# EAGLE design Potencia_2 (EAGLE 7.5.0)
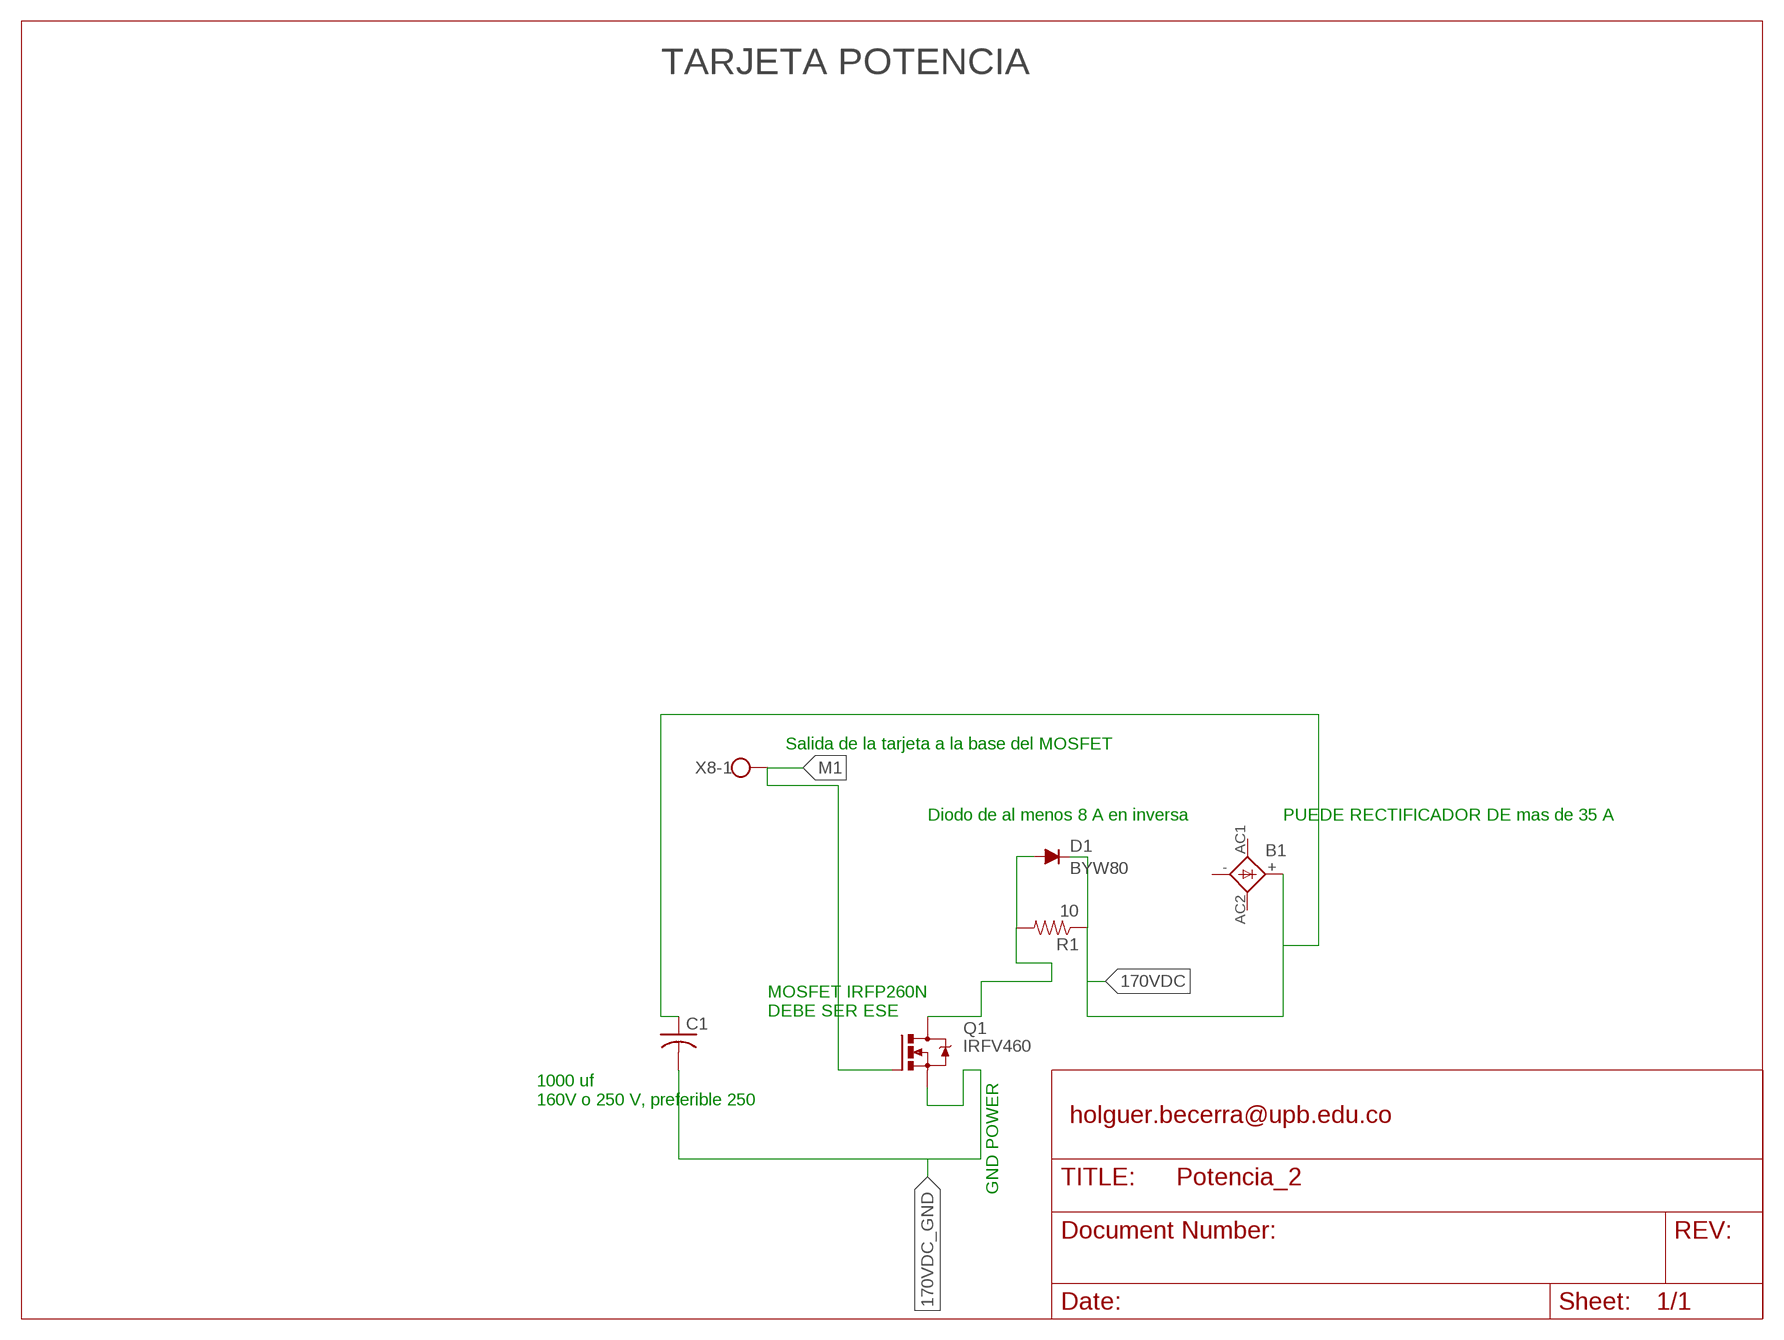
[diagram p0: schematic, sheet 1]

## Parts
B1  GBPC80X  [GBPC80X]
C1  C-US275-205X316  [C275-205X316]
D1  BYW80  [TO220ACS]
Q1  IRFV460  [TO258AA]
R1  10  10OHM-1/10W-5%0603SMD  [0603-RES]
X8  CBE2  [BE2]

## Nets
170VDC: B1.+ C1.1 D1.C R1.1
170VDC_GND: C1.2 Q1.2-S(S)
DAS: D1.A Q1.1-D(D) R1.2
M1: Q1.3-G(G) X8.1
Unconnected: B1.- B1.AC1 B1.AC2 X8.2

## Notes on the sheet
- TARJETA POTENCIA
- Salida de la tarjeta a la base del MOSFET
- Diodo de al menos 8 A en inversa | PUEDE RECTIFICADOR DE mas de 35 A
- MOSFET IRFP260N
  DEBE SER ESE
- 1000 uf
  160V o 250 V, preferible 250
- holguer.becerra@upb.edu.co
- GND POWER

## Library data of the parts
B1 = rectifier:GBPC80X: GENERAL INSTRUMENT RECTIFIER
C1 = adafruit:C-US: CAPACITOR, American symbol
D1 = diode:BYW80: DIODE high-efficiency fast recovery rectifier (ST)
Q1 = transistor-power:IRFV460: HEXFET N-Channel Transistor
R1 = SparkFun-Resistors:10OHM-1/10W-5%0603: RES-09834; PROD_ID: RES-09834
X8 = Bornera_tornillo_enchufable:CBE2

## Board
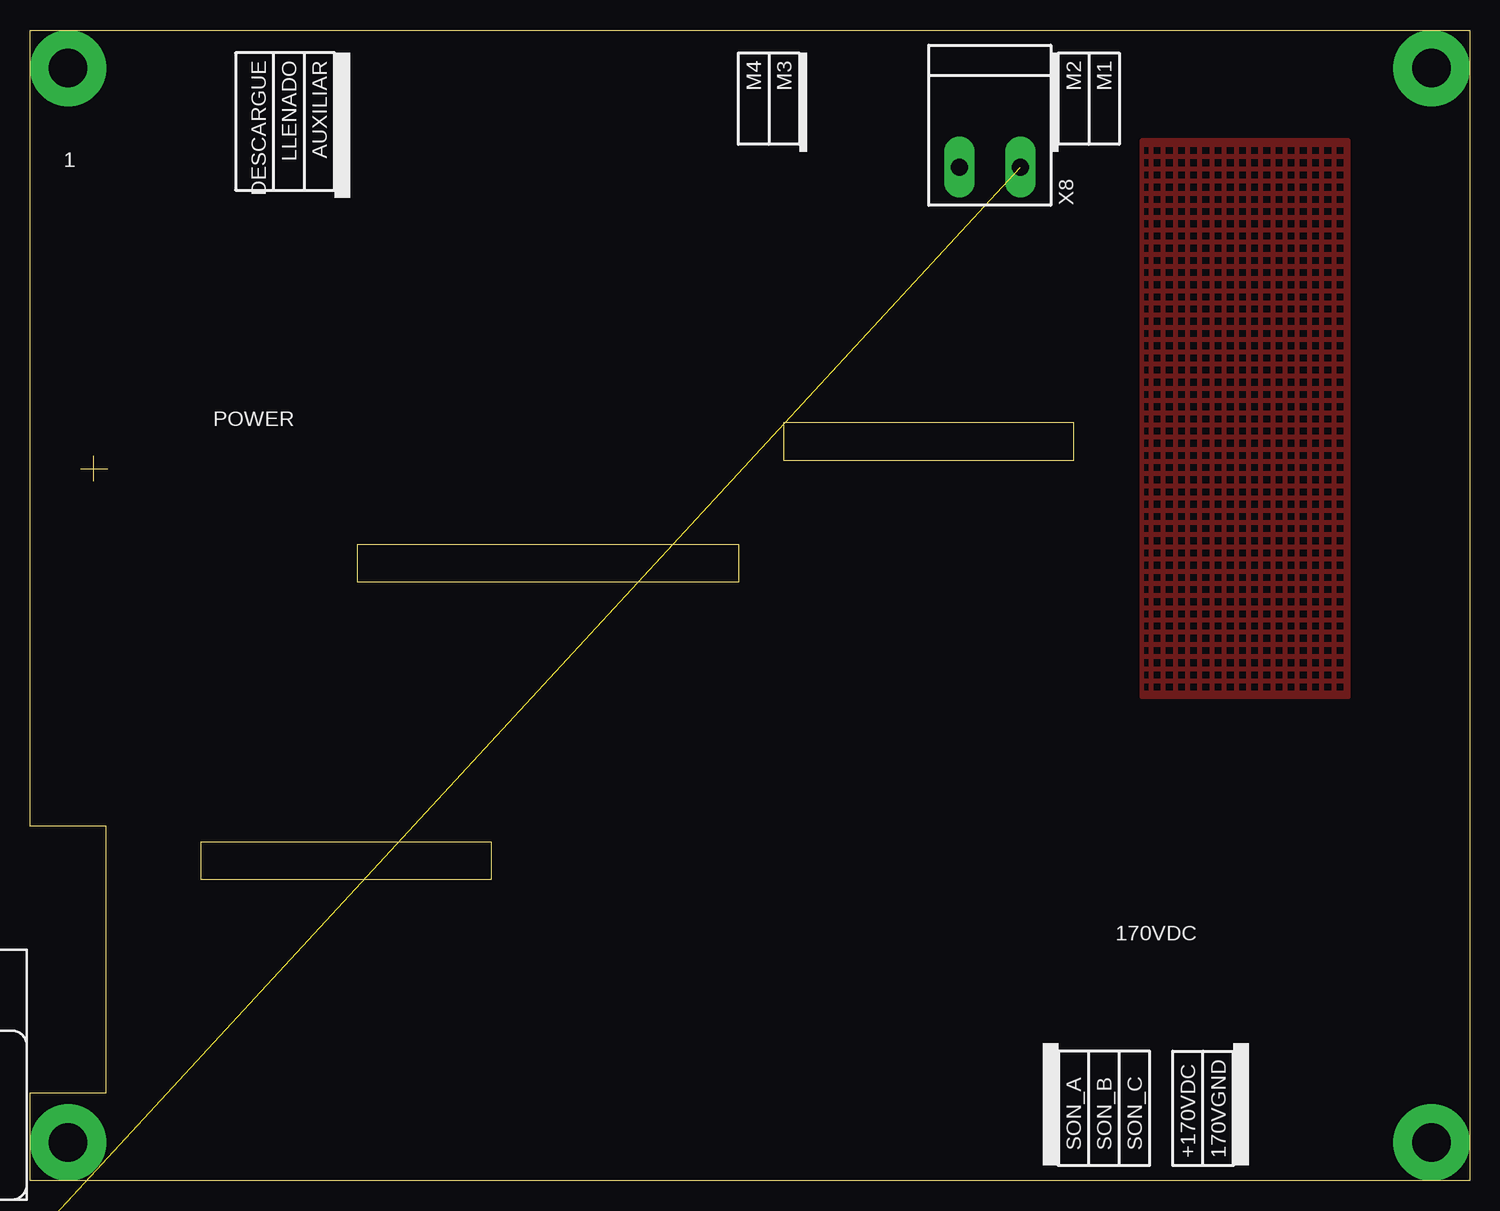
[diagram p1: board, top side]

Size 120.02 x 95.89 mm. Coordinates in mm from the lower left corner, seen from the top.
Outline: 4.25,59.33 6.47,59.33
Outline: 5.32,58.26 5.32,60.4
Outline: 120.02,0 0,0 0,7.3 6.35,7.3 6.35,29.53 0,29.53 0,95.89 120.02,95.89 120.02,0
Outline: 27.3,53.02 59.05,53.02 59.05,49.85 27.3,49.85 27.3,53.02
Outline: 62.87,63.18 87,63.18 87,60.01 62.87,60.01 62.87,63.18
Outline: 14.29,28.26 38.42,28.26 38.42,25.08 14.29,25.08 14.29,28.26
Copper layers (1*16): Top 0.035mm / dielectric 1.5mm / Bottom 0.035mm
Design rules "default *": minimum track width 10mil, minimum drill 24mil, track to track 8mil, track to pad 8mil, pad to pad 8mil, via to via 8mil, smd to smd 8mil, copper to edge 1mil, drill to drill 8mil, minimum pad ring 10mil, minimum via ring 8mil, stop-mask expansion 4mil, vias tented up to drill 0mil, thermal gap 10mil

### Footprints (pad centres in the part's own frame; a part is rotated, then mirrored left to right if it is on the bottom)
GBPC80X = drill 1.016 pad 2.54 octagon: + 6.35,6.35; - -6.35,-6.35; AC1 -6.35,6.35; AC2 6.35,-6.35
C275-205X316 = drill 1.194 octagon: 1 -13.716,0; 2 13.716,0
TO220ACS = drill 1.016 long: A 2.54,-2.54; C -2.54,-2.54
TO258AA = drill 1.651 long: 1-D -5.08,-25.4; 2-S 0,-25.4; 3-G 5.08,-25.4 | hole 4.191: 0,0
0603-RES = smd 1.1 x 1: 1 -0.85,0; 2 0.85,0
BE2 = drill 1.4 pad 2.54 long: 1 -2.54,0; 2 2.54,0

### Placement (x,y rotation side)
B1  -27.94,-10.16 0 top  (outside the outline)
C1  -22.23,-33.66 0 top  (outside the outline)
D1  -11.75,-12.38 0 top  (outside the outline)
Q1  -8.89,16.19 0 top  (outside the outline)
R1  1.59,-10.48 0 top  (outside the outline)
X8  80.01,84.45 180 top

### Tracks (layer width: path | path; a pad name or v marks a point on that pad's centre or on a via)
170VDC  (3 unrouted)
170VDC_GND  (1 unrouted)
DAS  (2 unrouted)
M1  (1 unrouted)
N$2  (via drill 3.2 pad 6.35)
  other vias: 3.17,92.71
N$3  (via drill 3.2 pad 6.35)
  other vias: 116.84,92.71
N$4  (via drill 3.2 pad 6.35)
  other vias: 116.84,3.17
N$5  (via drill 3.2 pad 6.35)
  other vias: 3.17,3.17
N$7
  pour Top (hatched): 92.71,86.68 109.86,86.68 109.86,40.32 92.71,40.32

### Text on the board
tPlace: DESCARGUE / LLENADO / AUXILIAR | M4 / M3 | M2 / M1 | 1 | POWER | 170VDC | SON_A / SON_B / SON_C | +170VDC / 170VGND